# EAGLE schematic Blank Arduino sheild (EAGLE 7.1.0)
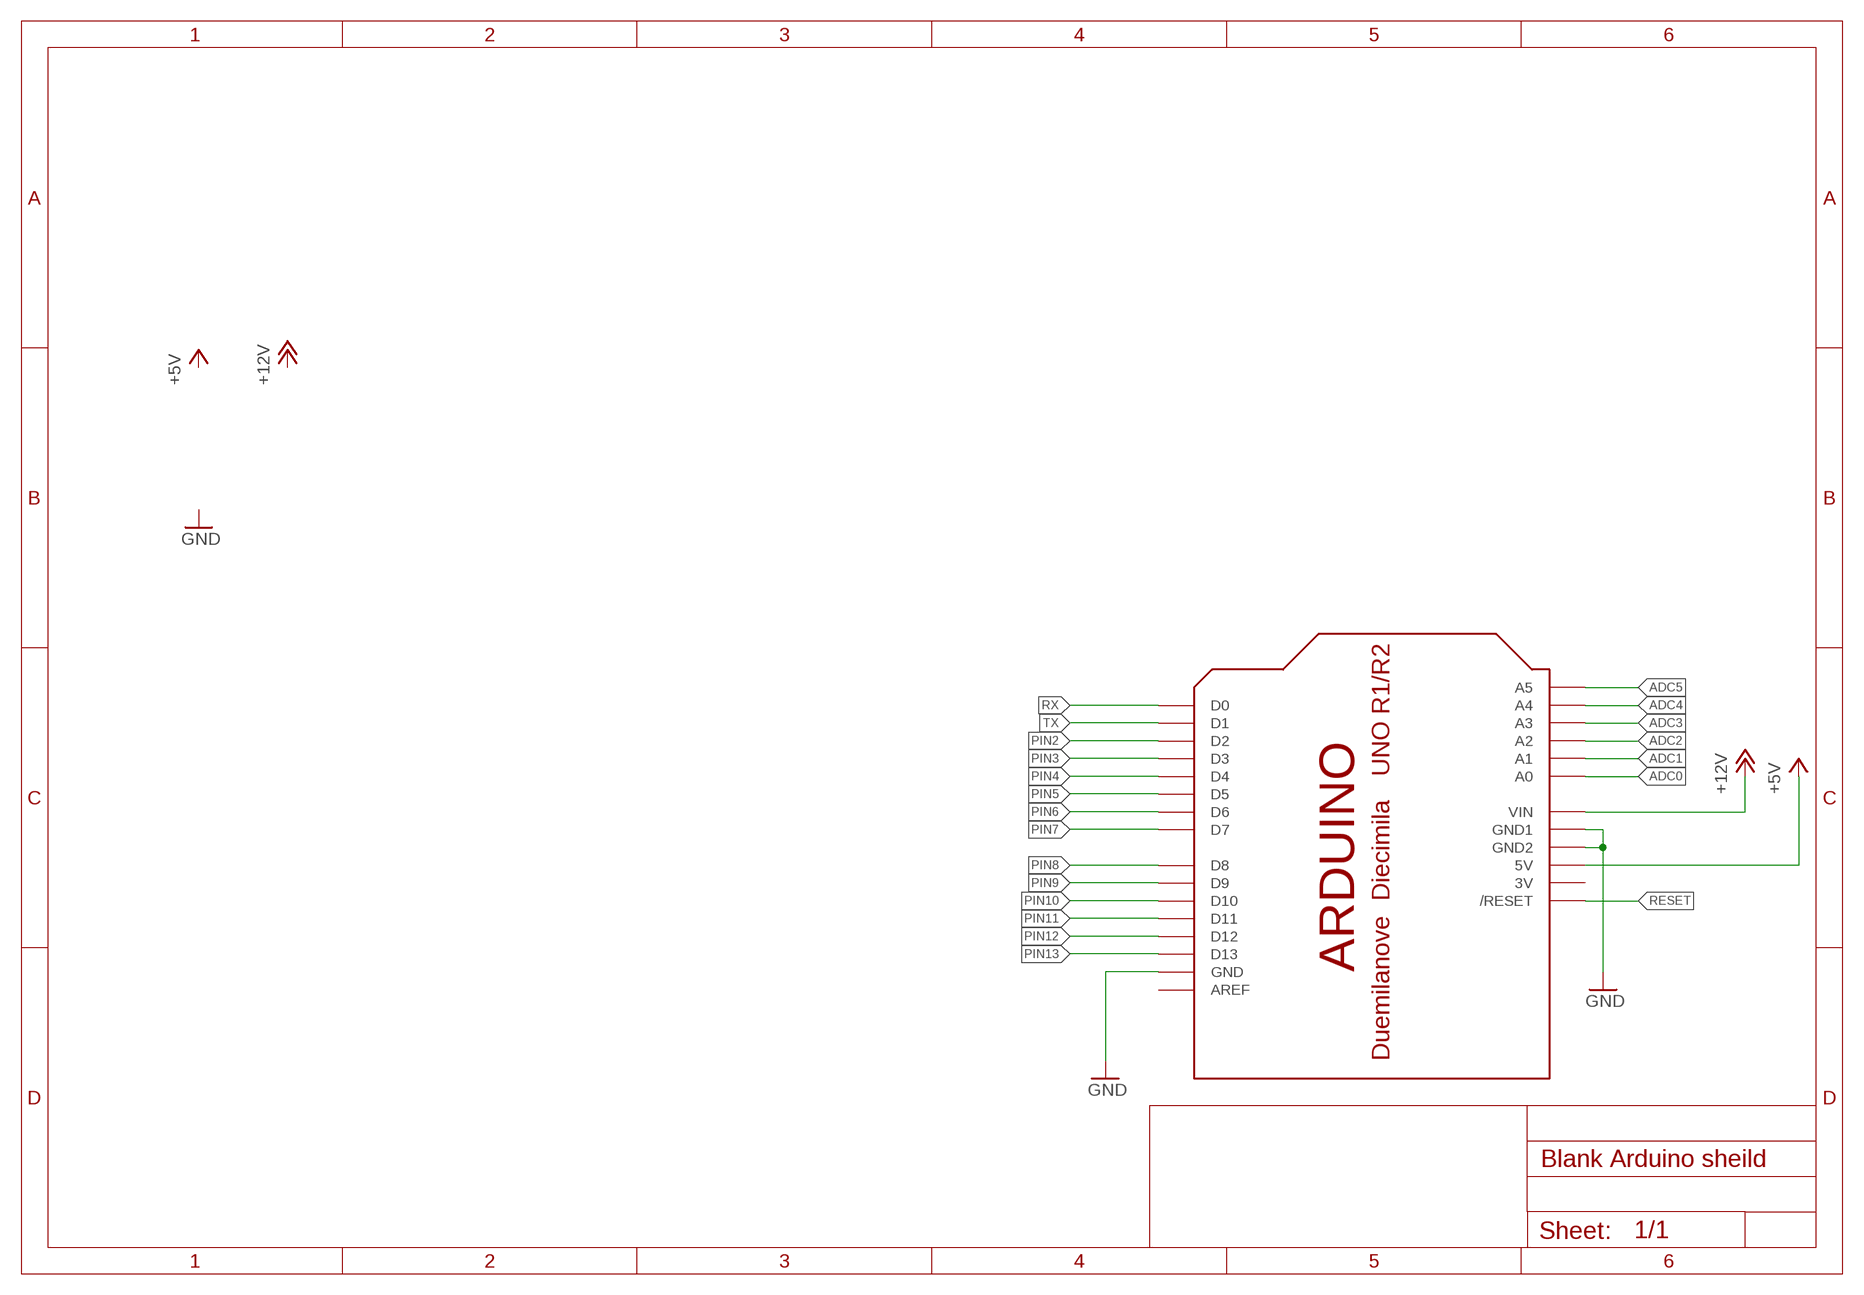
[diagram p0: schematic, sheet 1]

## Parts
U$1  ARDUINOUNO  [ARDUINO]

## Nets
+5V: U$1.5V
+12V [pwr]: U$1.VIN
ADC0: U$1.A0
ADC1: U$1.A1
ADC2: U$1.A2
ADC3: U$1.A3
ADC4: U$1.A4
ADC5: U$1.A5
GND [pwr]: U$1.GND U$1.GND1 U$1.GND2
PIN2: U$1.D2
PIN3: U$1.D3
PIN4: U$1.D4
PIN5: U$1.D5
PIN6: U$1.D6
PIN7: U$1.D7
PIN8: U$1.D8
PIN9: U$1.D9
PIN10: U$1.D10
PIN11: U$1.D11
PIN12: U$1.D12
PIN13: U$1.D13
RESET: U$1.RESET(/RESET)
RX: U$1.D0
TX: U$1.D1
Unconnected: U$1.AREF

## Power pins joined to a net without a drawn wire
3V: U$1.3V

## Library data of the parts
U$1 = adafruit:ARDUINO: Arduino Diecimila/Duemilanove Make a shield with ease, this package has all the named pins as well as the two mounting drill holes and an outline of the USB and DC power connector. The outline is on the DIMENSION layer, so if your board house uses it they will cut the outline to match. http://www.ladyada.net/library/pcb/eaglelibrary.html

## Net classes
0 default: width 0.4 mm
1 signal: width 0.254 mm
2 pwr: width 2 mm